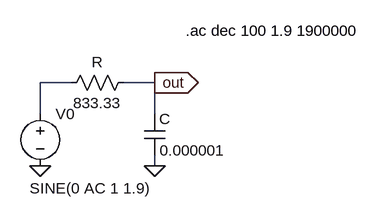
[diagram p0: schematic RC.asc]
RC.asc, the LTspice schematic file:
Version 4
SHEET 1 880 680
WIRE 96 64 48 64
WIRE 224 64 176 64
WIRE 48 112 48 64
WIRE 224 112 224 64
WIRE 224 192 224 176
FLAG 48 192 0
FLAG 224 192 0
FLAG 224 64 out
IOPIN 224 64 Out
SYMBOL res 192 48 R90
WINDOW 0 0 56 VBottom 2
WINDOW 3 32 56 VTop 2
SYMATTR InstName R
SYMATTR Value 833.33
SYMBOL cap 208 112 R0
WINDOW 0 32 8 Center 2
SYMATTR InstName C
SYMATTR Value 0.000001
SYMBOL voltage 48 96 R0
WINDOW 3 -16 131 Left 2
WINDOW 123 0 0 Left 0
WINDOW 39 0 0 Left 0
SYMATTR InstName V0
SYMATTR Value SINE(0 AC 1 1.9)
TEXT 272 -16 Left 2 !.ac dec 100 1.9 1900000

The netlist it stands for:
* RC.asc
R out N001 833.33
C out 0 0.000001
V0 N001 0 SINE(0 AC 1 1.9)
.ac dec 100 1.9 1900000
.backanno
.end